# EAGLE design BioMod (EAGLE 9.5.1)

## Sheet 1 of 2
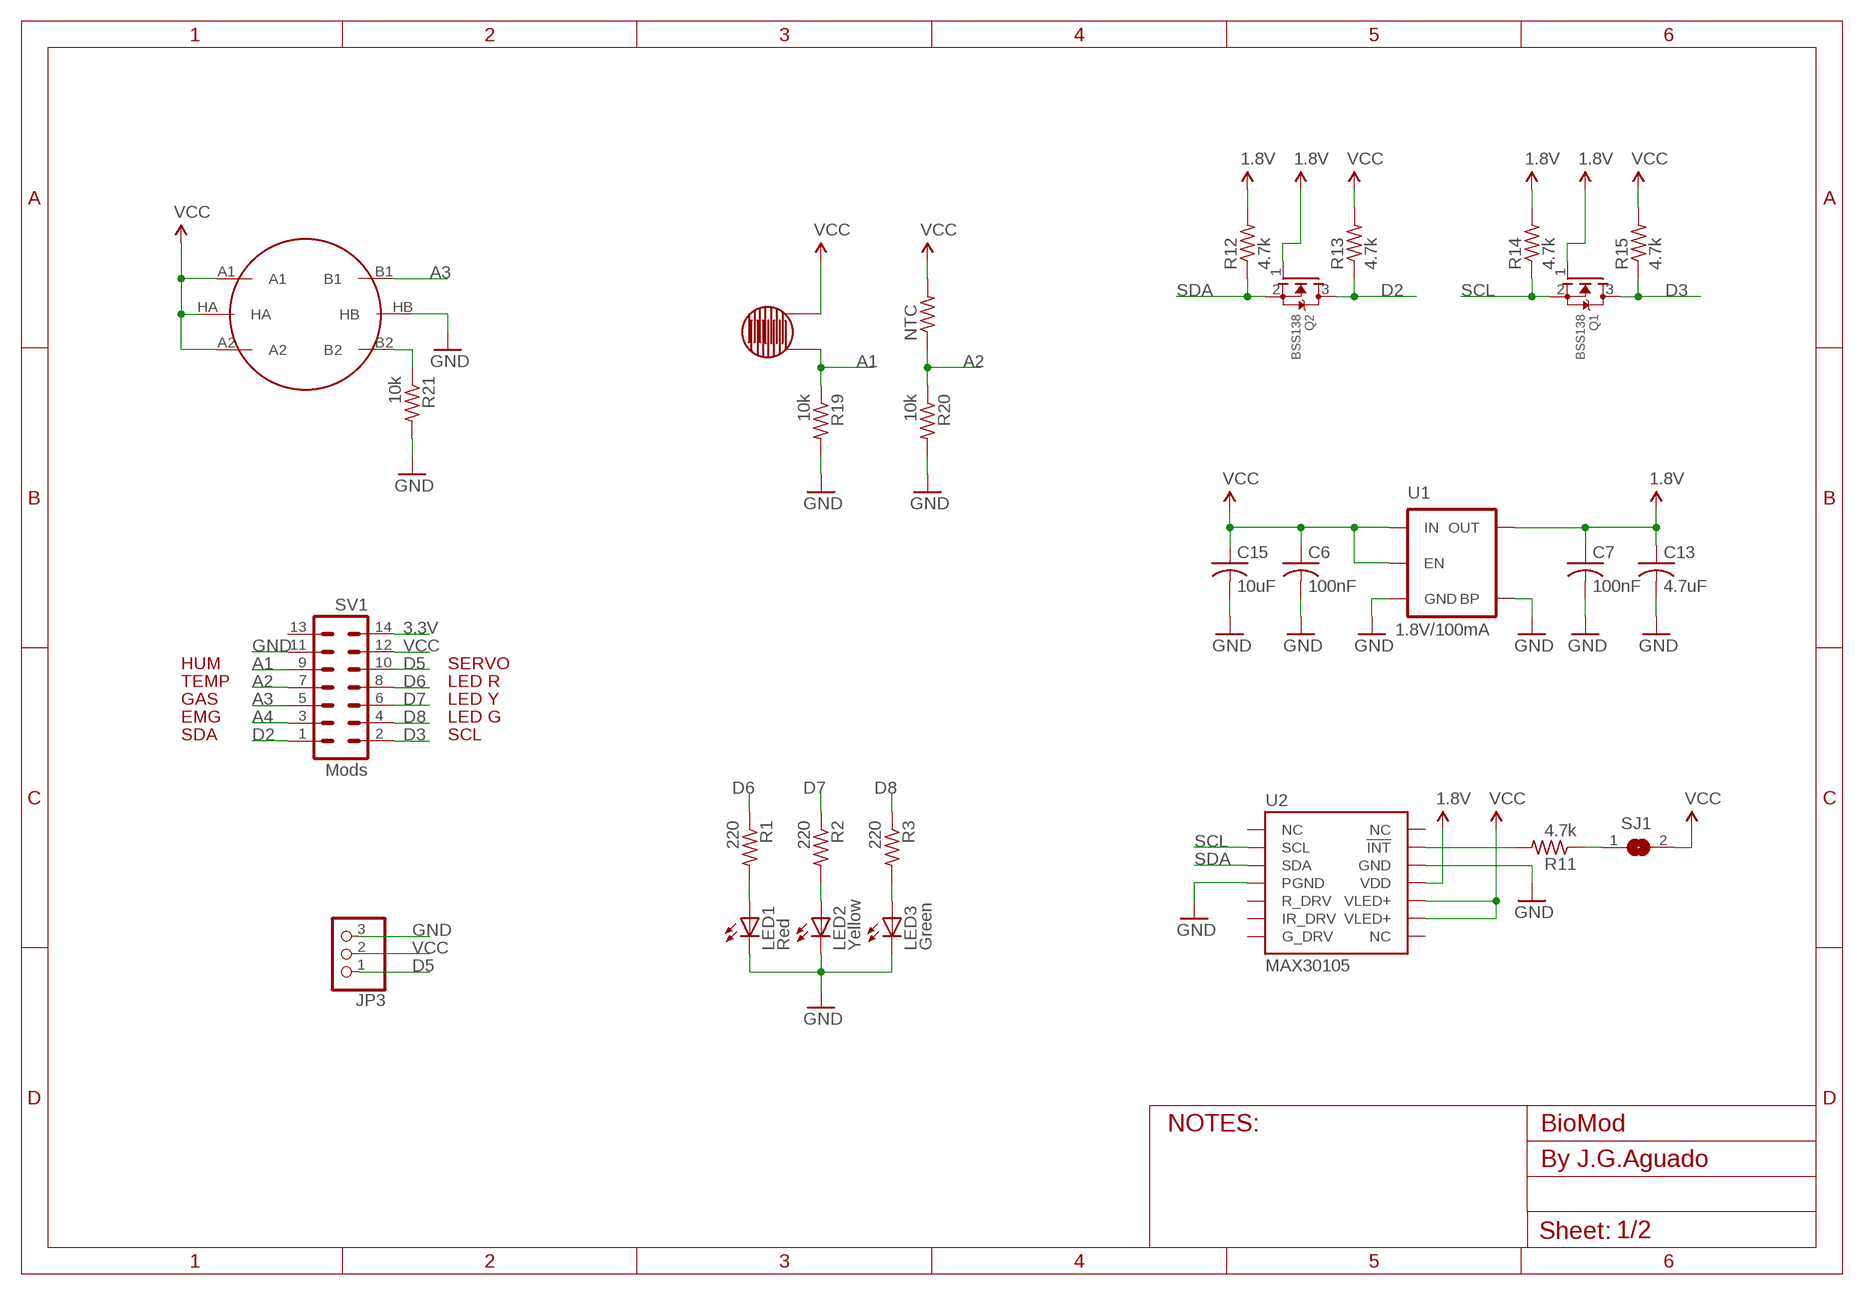
[diagram p0: schematic, sheet 1]

### Parts
C6  100nF  C-USC1206  [C1206]
C7  100nF  C-USC1206  [C1206]
C13  4.7uF  C-USC1206  [C1206]
C15  10uF  C-USC1206  [C1206]
JP3  PINHD-1X3  [1X03]
LED1  Red  LEDSMT1206  [1206]
LED2  Yellow  LEDSMT1206  [1206]
LED3  Green  LEDSMT1206  [1206]
NTC  R-US_R1206  [R1206]
Q1  BSS138  MOSFET-NREFLOW  [SOT23]
Q2  BSS138  MOSFET-NREFLOW  [SOT23]
R1  220  R-US_R1206  [R1206]
R2  220  R-US_R1206  [R1206]
R3  220  R-US_R1206  [R1206]
R11  4.7k  R-US_R1206  [R1206]
R12  4.7k  R-US_R1206  [R1206]
R13  4.7k  R-US_R1206  [R1206]
R14  4.7k  R-US_R1206  [R1206]
R15  4.7k  R-US_R1206  [R1206]
R19  10k  R-US_R1206  [R1206]
R20  10k  R-US_R1206  [R1206]
R21  10k  R-US_R1206  [R1206]
SJ1  SJ  [SJ]
SNG  METHANE_SENSOR  [MQ-3]
SV1  Mods  MA07-2  [MA07-2]
U1  1.8V/100mA  V_REG_SP62141.8V  [SC70]
U2  MAX30105  MAX30105SMD  [OLGA-14]
U$16  RESISTIVE_SENSOR_PAD  [RESISTIVE_SENSOR_PAD]

### Nets
1.8V: C7.1 C13.1 Q1.1(G) Q2.1(G) R12.2 R14.2 U1.5(OUT) U2.11(VDD)
3.3V: SV1.14
A1: R19.1 SV1.9 U$16.1
A2: NTC.1 R20.1 SV1.7
A3: SNG.B1 SV1.5
A4: SV1.3 ; also sheet 2
D2: Q2.3(D) R13.1 SV1.1
D3: Q1.3(D) R15.1 SV1.2
D5: JP3.1 SV1.10
D6: R1.1 SV1.8
D7: R2.1 SV1.6
D8: R3.1 SV1.4
GND: C6.2 C7.2 C13.2 C15.2 JP3.3 LED1.C LED2.C LED3.C R19.2 R20.2 R21.2 SNG.HB SV1.11 U1.2(GND) U1.4(BP) U2.4(PGND) U2.12(GND) ; also sheet 2
N$3: R11.1 SJ1.1
N$4: R11.2 U2.13(!INT)
N$11: R21.1 SNG.B2
N$12: LED2.A R2.2
N$13: LED3.A R3.2
N$14: LED1.A R1.2
SCL: Q1.2(S) R14.1 U2.2(SCL)
SDA: Q2.2(S) R12.1 U2.3(SDA)
VCC: C6.1 C15.1 JP3.2 NTC.2 R13.2 R15.2 SJ1.2 SNG.A1 SNG.A2 SNG.HA SV1.12 U1.1(IN) U1.3(EN) U2.9(VLED+) U2.10(VLED+) U$16.0 ; also sheet 2
Unconnected: SV1.13 U2.1(NC) U2.5(R_DRV) U2.6(IR_DRV) U2.7(G_DRV) U2.8(NC) U2.14(NC)

### Notes on the sheet
- HUM | SERVO
- TEMP | LED R
- GAS | LED Y
- EMG | LED G
- SDA | SCL

## Sheet 2 of 2
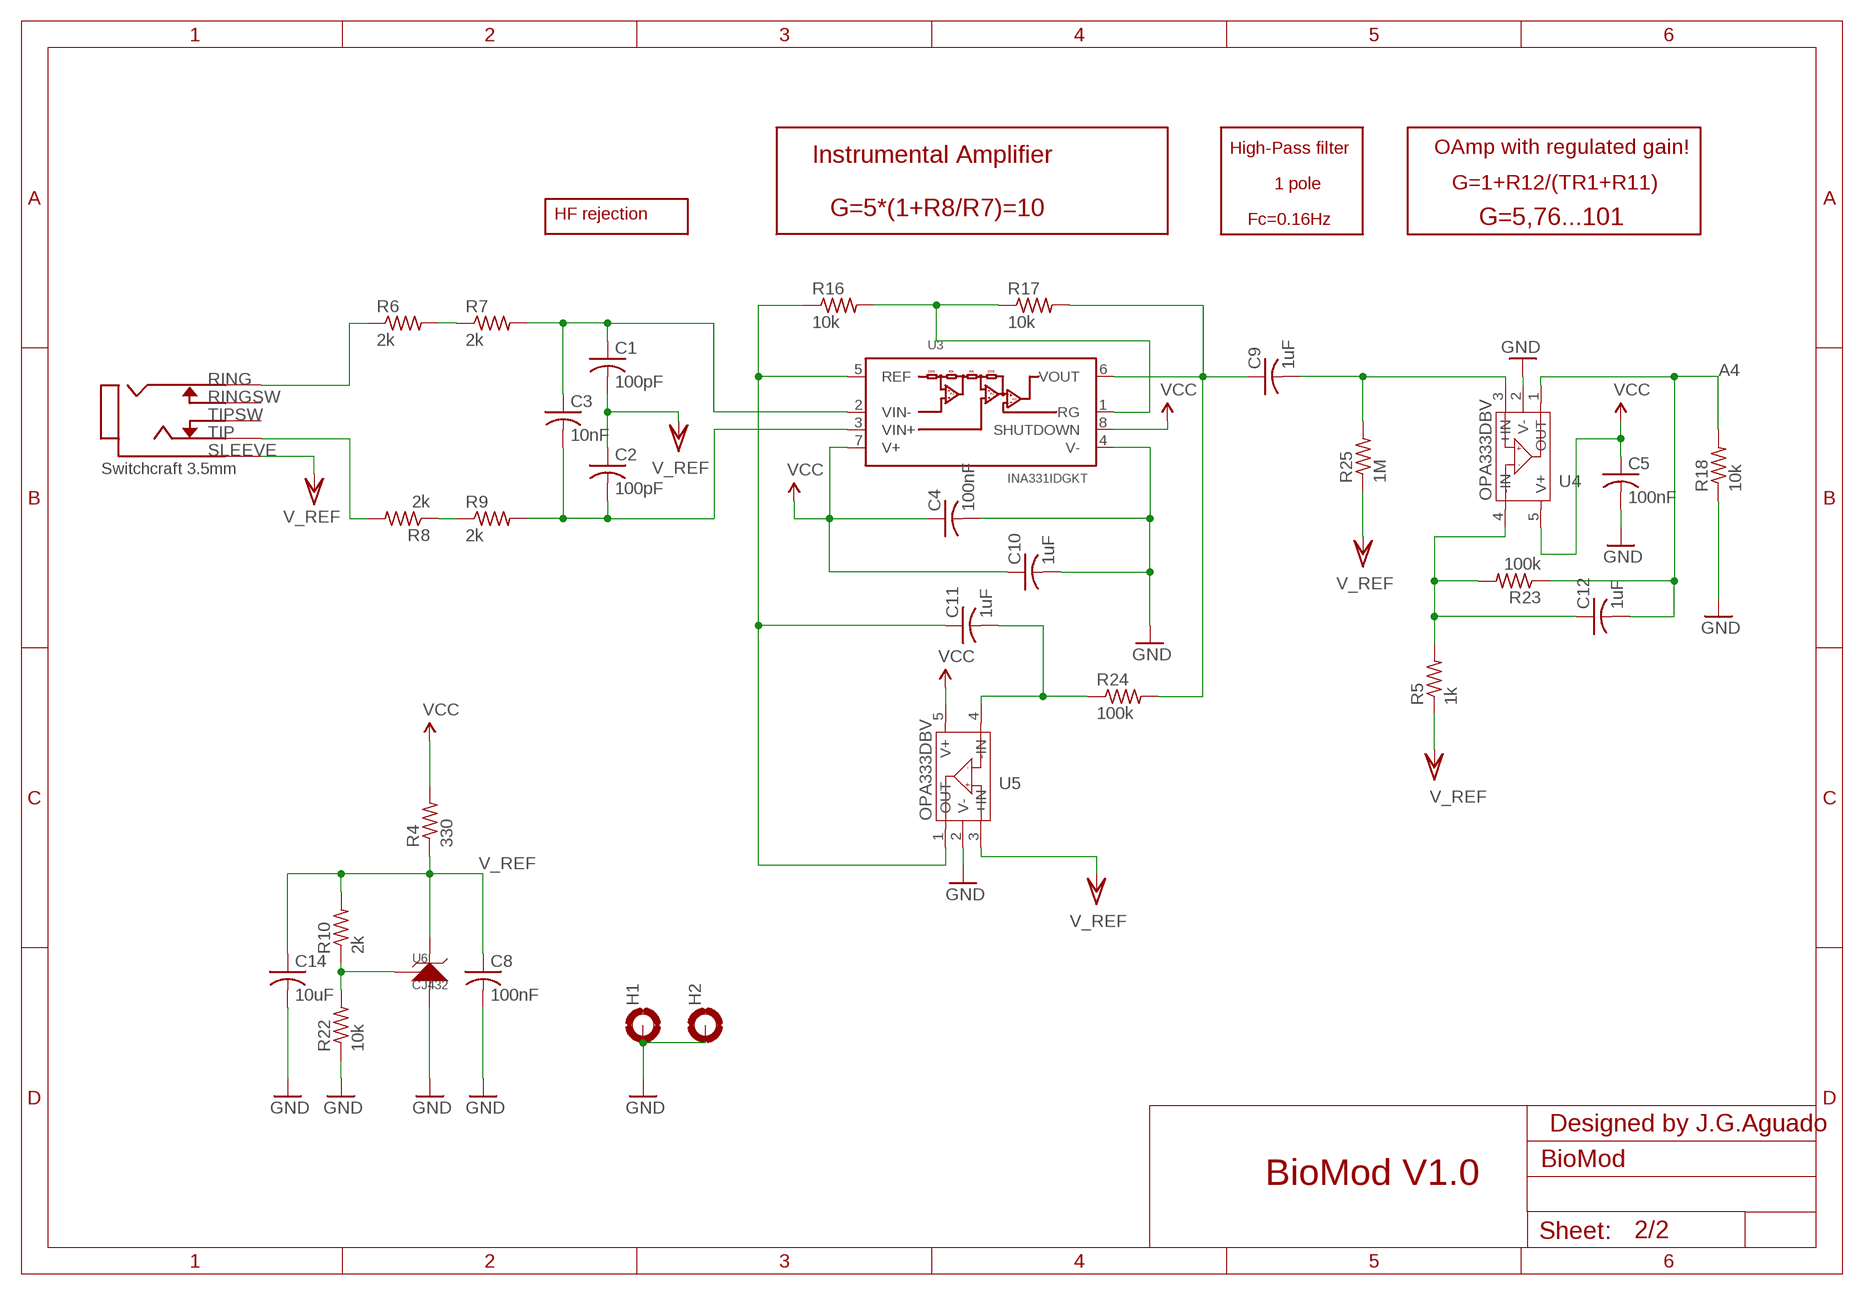
[diagram p1: schematic, sheet 2]

### Parts
C1  100pF  C-USC1206  [C1206]
C2  100pF  C-USC1206  [C1206]
C3  10nF  C-USC1206  [C1206]
C4  100nF  C-USC1206  [C1206]
C5  100nF  C-USC1206  [C1206]
C8  100nF  C-USC1206  [C1206]
C9  1uF  C-USC1206  [C1206]
C10  1uF  C-USC1206  [C1206]
C11  1uF  C-USC1206  [C1206]
C12  1uF  C-USC1206  [C1206]
C14  10uF  C-USC1206  [C1206]
H1  MOUNT-PAD-ROUND3.2  [3,2-PAD]
H2  MOUNT-PAD-ROUND3.2  [3,2-PAD]
JC1  SWTCHCRFT_3.5JACK5-JACK-SMD  [4-JACK-SMD]
R4  330  R-US_R1206  [R1206]
R5  1k  R-US_R1206  [R1206]
R6  2k  R-US_R1206  [R1206]
R7  2k  R-US_R1206  [R1206]
R8  2k  R-US_R1206  [R1206]
R9  2k  R-US_R1206  [R1206]
R10  2k  R-US_R1206  [R1206]
R16  10k  R-US_R1206  [R1206]
R17  10k  R-US_R1206  [R1206]
R18  10k  R-US_R1206  [R1206]
R22  10k  R-US_R1206  [R1206]
R23  100k  R-US_R1206  [R1206]
R24  100k  R-US_R1206  [R1206]
R25  1M  R-US_R1206  [R1206]
U3  INA331IDGKT  INA331EA  [MSOP-8]
U4  OPA333DBV  [SOT23-5]
U5  OPA333DBV  [SOT23-5]
U6  CJ432  REFERENCE-SOURCE  [SOT23]

### Nets
A4: C12.2 R18.2 R23.1 U4.1(OUT) ; also sheet 1
GND: C4.2 C5.2 C8.2 C10.2 C14.2 H1.B3,2(MOUNT) H2.B3,2(MOUNT) R18.1 R22.1 U3.4(V-) U4.2(V-) U5.2(V-) U6.3(A) ; also sheet 1
N$1: R8.1 R9.1
N$6: C11.2 R24.1 U5.4(-IN)
N$7: R6.2 R7.1
N$9: C11.1 R16.1 U3.5(REF) U5.1(OUT)
N$10: R16.2 R17.1 U3.1(RG)
N$15: JC1.2 R6.1
N$16: JC1.3 R8.2
N$22: R10.1 R22.2 U6.1(R)
N$83: C9.1 R17.2 R24.2 U3.6(VOUT)
N$92: C2.2 C3.2 R9.2 U3.3(VIN+)
N$93: C1.1 C3.1 R7.2 U3.2(VIN-)
N$102: C9.2 R25.2 U4.3(+IN)
N$105: C12.1 R5.2 R23.2 U4.4(-IN)
V_REF: C1.2 C2.1 C8.1 C14.1 JC1.1 R4.1 R5.1 R10.2 R25.1 U5.3(+IN) U6.2(K)
VCC: C4.1 C5.1 C10.1 R4.2 U3.7(V+) U3.8(SHUTDOWN) U4.5(V+) U5.5(V+) ; also sheet 1
Unconnected: JC1.4 JC1.5

### Notes on the sheet
- High-Pass filter | OAmp with regulated gain!
- Instrumental Amplifier
- 1 pole | G=1+R12/(TR1+R11)
- HF rejection
- G=5*(1+R8/R7)=10
- Fc=0.16Hz | G=5,76...101
- Designed by J.G.Aguado
- BioMod V1.0

## Library data of the parts
C1-C15 = resistor:C-US: CAPACITOR, American symbol
H1 H2 = holes:MOUNT-PAD-ROUND: MOUNTING PAD, round
JC1 = jmsaavedra:SWTCHCRFT_3.5JACK: Switchcraft 3.5mm Stereo Audio Jack manufacturer: 35RASMT4BHNTRX digikey: SC1488-1-ND
JP3 = pinhead:PINHD-1X3: PIN HEADER
LED1-LED3 = led:LED: LED OSRAM: - CHIPLED LG R971, LG N971, LY N971, LG Q971, LY Q971, LO R971, LY R971 LH N974, LH R974 LS Q976, LO Q976, LY Q976 LO Q996 - Hyper CHIPLED LW Q18S LB Q993, LB Q99A, LB R99A - SideLED LS A670, LO A670, LY A670, LG A670, LP A670 LB A673, LV A673, LT A673, LW A673 LH A674 LY A675 LS A676, LA A676, LO A676, LY A676, LW A676 LS A679, LY A679, LG A679 - Hyper Micro SIDELED® LS Y876, LA Y876, LO Y876, LY Y876 LT Y87S - SmartLED LW L88C, LW L88S LB L89C, LB L89S, LG L890 LS L89K, LO L89K, LY L89K LS L896, LA L896, LO L896, LY L896 - TOPLED LS T670, LO T670, LY T670, LG T670, LP T670 LSG T670, LSP T670, LSY T670, LOP T670, LYG T670 LG T671, LOG T671, LSG T671 LB T673, LV T673, LT T673, LW T673 LH T674 LS T676, LA T676, LO T676, LY T676, LB T676, LH T676, LSB T676, LW T676 LB T67C, LV T67C, LT T67C, LS T67K, LO T67K, LY T67K, LW E67C LS E67B, LA E67B, LO E67B, LY E67B, LB E67C, LV E67C, LT E67C LW T67C LS T679, LY T679, LG T679 LS T770, LO T770, LY T770, LG T770, LP T770 LB T773, LV T773, LT T773, LW T773 LH T774 LS E675, LA E675, LY E675, LS T675 LS T776, LA T776, LO T776, LY T776, LB T776 LHGB T686 LT T68C, LB T68C - Hyper Mini TOPLED® LB M676 - Mini TOPLED Santana® LG M470 LS M47K, LO M47K, LY M47K Source: http://www.osram.convergy.de LUXEON: - LUMILED® LXK2-PW12-R00, LXK2-PW12-S00, LXK2-PW14-U00, LXK2-PW14-V00 LXK2-PM12-R00, LXK2-PM12-S00, LXK2-PM14-U00 LXK2-PE12-Q00, LXK2-PE12-R00, LXK2-PE12-S00, LXK2-PE14-T00, LXK2-PE14-U00 LXK2-PB12-K00, LXK2-PB12-L00, LXK2-PB12-M00, LXK2-PB14-N00, LXK2-PB14-P00, LXK2-PB14-Q00 LXK2-PR12-L00, LXK2-PR12-M00, LXK2-PR14-Q00, LXK2-PR14-R00 LXK2-PD12-Q00, LXK2-PD12-R00, LXK2-PD12-S00 LXK2-PH12-R00, LXK2-PH12-S00 LXK2-PL12-P00, LXK2-PL12-Q00, LXK2-PL12-R00 Source: www.luxeon.com KINGBRIGHT: KA-3528ASYC Source: www.kingbright.com
NTC = adafruit:R-US_: RESISTOR, American symbol
Q1 Q2 = adafruit:MOSFET-N: N-Channel Mosfet 2N7002E - 60V 260mA SOT23 [Digikey: 2N7002ET1GOSTR-ND] - REEL BSH103 - 30V 850mA SOT23 [Digikey: 568-5013-1-ND]
R1-R25 = resistor:R-US_: RESISTOR, American symbol
SJ1 = jumper:SJ: SMD solder JUMPER
SNG = SparkFun-Sensors:METHANE_SENSOR: MQ-4 Methane Gas Sensor SEN-09404
SV1 = con-lstb:MA07-2: PIN HEADER; OC_FARNELL: unknown; OC_NEWARK: unknown
U1 = SparkFun-PowerIC:V_REG_SP6214; PROD_ID: VREG-08428
U2 = SparkFun-Sensors:MAX30105: Description: Particle Detection IC. Primarily used for smoke detection, can be used for Pulse Detection, Pulse Ox, and possible visual particle detection.; PROD_ID: IC-13510
U3 = template:INA331
U4 U5 = IC:OPA333: 1.8V,Micro power CMOS oprational amplifiers Zero-Drift Series http://www.ti.com.cn/cn/lit/ds/symlink/opa333.pdf
U6 = For_Test_Albert_v6:REFERENCE-SOURCE: CJ432,AZ432 or other Adjustable Reference Source
U$16 = SpaceDIY:RESISTIVE_SENSOR_PAD

## Net classes
1 pwr: width 0.152 mm, drill 0.305 mm, clearance 0.152 mm

## Board
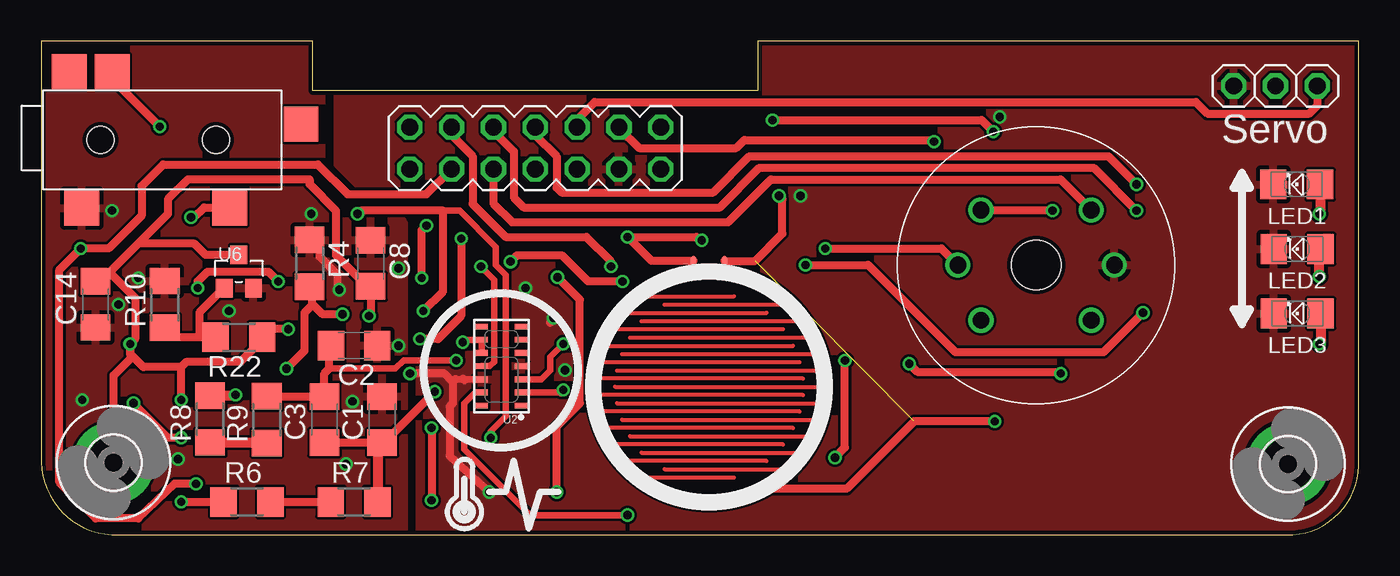
[diagram p2: board, top side]
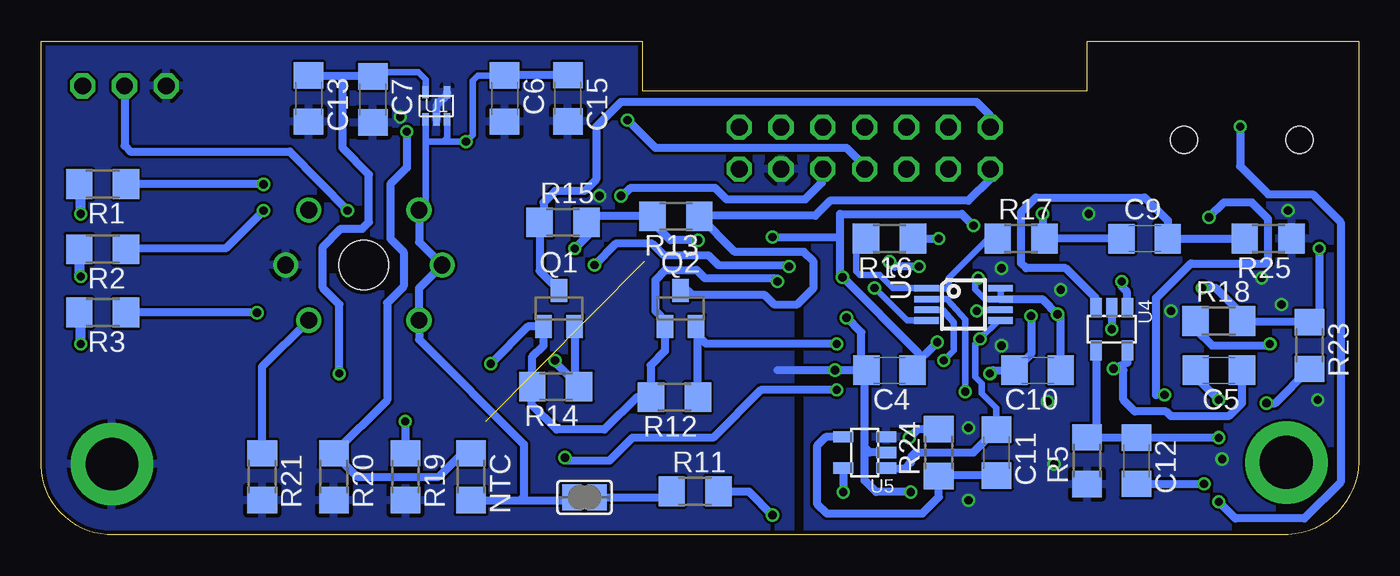
[diagram p3: board, bottom side, seen from below]

Size 80 x 30 mm. Coordinates in mm from the lower left corner, seen from the top.
Outline: 0,30 0,4.41 arc90 4.71,0 75.6,0 arc90 80,4.2 80,30 43.5,30 43.5,27 16.5,27 16.5,30 0,30
Copper layers (1*16): Top 0.035mm / dielectric 1.5mm / Bottom 0.035mm
Design rules "ITead_rule": minimum track width 6mil, minimum drill 12mil, track to track 6mil, track to pad 6mil, pad to pad 6mil, via to via 6mil, smd to smd 0mil, copper to edge 10mil, drill to drill 10mil, minimum pad ring 10mil, minimum via ring 6mil, stop-mask expansion 2mil, vias tented up to drill 100mil, thermal gap 10mil

### Footprints (pad centres in the part's own frame; a part is rotated, then mirrored left to right if it is on the bottom)
C1206 = smd 1.6 x 1.8: 1 -1.4,0; 2 1.4,0
3,2-PAD = drill 3.2 pad 5: B3,2 0,0
4-JACK-SMD = smd 2.108 x 2.108: 1 2.362,-1.143; 2 4.216,7.137; 3 11.354,-1.143; 4 1.6,7.137; 5 15.672,3.962 | hole 1.651: 3.505,2.997; 10.516,2.997
1X03 = drill 1.016 octagon: 1 -2.54,0; 2 0,0; 3 2.54,0
1206 = smd 1.6 x 1.803: A -1.422,0; C 1.422,0
R1206 = smd 1.6 x 1.803: 1 -1.422,0; 2 1.422,0
SOT23 = smd 1 x 1.4: 1 -0.95,-1.1; 2 0.95,-1.1; 3 0,1.1
SJ = smd 1.168 x 1.6: 1 -0.762,0; 2 0.762,0
MQ-3 = drill 1.016: A1 -3.35,3.35; A2 -3.35,-3.35; B1 3.35,3.35; B2 3.35,-3.35; HA -4.75,0; HB 4.75,0 | hole 3: 0,0
MA07-2 = drill 1.016 octagon: 1 -7.62,-1.27; 2 -7.62,1.27; 3 -5.08,-1.27; 4 -5.08,1.27; 5 -2.54,-1.27; 6 -2.54,1.27; 7 0,-1.27; 8 0,1.27; 9 2.54,-1.27; 10 2.54,1.27; 11 5.08,-1.27; 12 5.08,1.27; 13 7.62,-1.27; 14 7.62,1.27
SC70 = smd 0.4 x 0.75: 1 -0.65,-0.825; 2 0,-0.825; 3 0.65,-0.825; 4 0.65,0.825; 5 -0.65,0.825
OLGA-14 = smd 0.75 x 0.35: 1 -1.2,2.4; 2 -1.2,1.6; 3 -1.2,0.8; 4 -1.2,0; 5 -1.2,-0.8; 6 -1.2,-1.6; 7 -1.2,-2.4; 8 1.2,-2.4; 9 1.2,-1.6; 10 1.2,-0.8; 11 1.2,0; 12 1.2,0.8; 13 1.2,1.6; 14 1.2,2.4
MSOP-8 = smd 0.4 x 1.5: 1 -0.975,-2.25; 2 -0.325,-2.25; 3 0.325,-2.25; 4 0.975,-2.25; 5 0.975,2.25; 6 0.325,2.25; 7 -0.325,2.25; 8 -0.975,2.25
SOT23-5 = smd 0.69 x 1.2: 1 -0.95,-1.3; 2 0,-1.3; 3 0.95,-1.3; 4 0.95,1.3; 5 -0.95,1.3
SOT23' = smd 1.016 x 1.143: 1 -0.889,-1.016; 2 0.889,-1.016; 3 0,1.016
RESISTIVE_SENSOR_PAD = smd 0.305 x 0.61: 0 -0.95,7.65; 1 0.95,7.65

### Placement (x,y rotation side)
C1  20.7,7 90 top
C2  19,11.5 180 top
C3  17.2,7 90 top
C4  28.5,10 180 bottom
C5  8.5,10 180 bottom
C6  51.86,26.51 270 bottom
C7  59.86,26.46 270 bottom
C8  20,16.5 270 top
C9  13,18 0 bottom
C10  19.5,10 180 bottom
C11  22,5 270 bottom
C12  13.5,4.5 270 bottom
C13  63.76,26.51 270 bottom
C14  3.3,14 90 top
C15  48.02,26.53 270 bottom
H1  4.4,4.4 0 top
H2  75.7,4.3 0 top
JC1  0.1,21 0 top
JP3  74.94,27.28 180 top
LED1  76.23,21.29 180 top
LED2  76.26,17.37 180 top
LED3  76.26,13.45 180 top
NTC  53.9,3.53 270 bottom
Q1  48.56,13.75 0 bottom
Q2  41.18,13.75 0 bottom
R1  76.27,21.31 180 bottom
R2  76.27,17.36 180 bottom
R3  76.27,13.51 180 bottom
R4  16.3,16.5 270 top
R5  16.5,4.5 90 bottom
R6  12.5,2 0 top
R7  19,2 0 top
R8  10.26,7.04 90 top
R9  13.7,7 90 top
R10  7.5,14 90 top
R11  40.29,2.64 0 bottom
R12  41.55,8.36 180 bottom
R13  41.47,19.36 180 bottom
R14  48.76,9.01 180 bottom
R15  48.32,18.99 0 bottom
R16  28.5,18 180 bottom
R17  20.5,18 0 bottom
R18  8.5,13 0 bottom
R19  57.88,3.53 270 bottom
R20  62.23,3.53 270 bottom
R21  66.58,3.53 270 bottom
R22  12,12 180 top
R23  3,11.5 270 bottom
R24  25.5,5 90 bottom
R25  5.5,18 180 bottom
SJ1  47.01,2.28 180 bottom
SNG  60.41,16.39 0 top
SV1  30,23.5 0 top
U1  56.01,26.07 0 bottom
U2  27.94,10.25 180 top
U3  24,14 270 bottom
U4  15,12.5 180 bottom
U5  30,5 90 bottom
U6  CJ432  [SOT23']  12,16 0 top
U$16  40.55,8.99 0 top

### Tracks (layer width: path | path; a pad name or v marks a point on that pad's centre or on a via)
1.8V  (via drill 0.5)
  Top 0.406: U2.11 27.25,10.25 27.5,10.5 27.5,15.5 v26.7,16.3
  Top 0.5: v28.5,16.6 28.9,17 31.6,17 33.2,15.4 v35.3,15.4 | v52.7,10.4 53.2,9.9 61.8,9.9 v61.9,9.8
  Bottom 0.406: U1.5 56.66,27.66 57.1,28.1 59.62,28.1 C7.1
  Bottom 0.5: v26.7,16.3 28.2,16.3 v28.5,16.6 | C7.1 61.9,27.86 | 61.9,27.86 63.71,27.86 C13.1 | v52.7,10.4 50.45,12.65 Q1.1 49.51,11.49 50.2,10.8 50.2,9.03 R14.2 50.2,8.99 50.2,7.9 48.7,6.4 45.8,6.4 43.84,8.36 R12.2 43,8.39 43,10.3 42.13,11.17 Q2.1 41.9,12.88 41.98,12.88 42.7,13.6 42.7,15.5 42.1,16.1 40.2,16.1 39.7,15.6 35.3,15.6 v35.3,15.4 | v61.9,9.8 61.9,14 62.9,15 62.9,17.5 61.8,18.6 60.5,18.6 60.1,19 60.1,21.9 61.7,23.5 61.7,27.66 61.9,27.86
A1  (via drill 0.5)  (1 unrouted)
  Top 0.5: v57.9,6.9 53,6.9 48.9,2.8 44.2,2.8 | U$16.1 43.34,16.64 45,18.3 45,20.4 v44.8,20.6
  Bottom 0.5: R19.1 57.88,6.88 v57.9,6.9 | v44.8,20.6 44.7,20.6 44.2,21.1 39.1,21.1 38.4,20.4 33.6,20.4 32.6,21.4 32.6,22.17 SV1.9
A2  (via drill 0.5)
  Top 0.5: v44.4,25.2 57.1,25.2 v57.8,24.5
  Bottom 0.5: NTC.1 54.45,4.95 55.9,3.5 60.78,3.5 R20.1 59,8.18 59,14.1 58,15.1 58,17.2 58.8,18 58.8,21.3 57.8,22.3 v57.8,24.5 | SV1.7 30,22.4 31.1,23.5 42.7,23.5 v44.4,25.2
A3
  Top 0.5: SV1.5 27.46,20.14 28.6,19 41.7,19 44.3,21.6 61.9,21.6 SNG.B1
A4  (via drill 0.5)
  Top 0.5: v9.5,15 9.5,15.4 10.1,16 13.8,16 v14.4,15.4 | v9.4,3.1 8.1,3.1 5.9,1 3.3,1 1.1,3.2 1.1,16.1 v2.4,17.4 4.1,17.4 6.1,19.4 6.1,21.2 7.4,22.5 16.8,22.5 18.6,20.7 23.39,20.7 SV1.3
  Bottom 0.5: v14.4,15.4 14.4,15.1 14.1,14.8 14.1,13.85 U4.1 | v9.5,15 8.7,15 7.08,13.38 R18.2 7,12.92 R23.1 2.4,13.52 v2.4,17.4 | C12.2 v9.4,3.1
D2
  Bottom 0.5: SV1.1 22.38,21.62 23.7,20.3 32.1,20.3 33,19.4 40.01,19.4 R13.1 37.89,17.2 33.7,17.2 33.1,16.6 33.1,15 34.1,14 35.5,14 36.1,14.6 40.5,14.6 40.75,14.85 Q2.3
D3
  Bottom 0.5: Q1.3 49.74,16.03 R15.1 49.5,19.23 49.5,20.2 48.8,20.9 47,20.9 46.3,21.6 46.3,24.8 44.8,26.3 23.2,26.3 22.38,25.48 SV1.2
D5
  Top 0.5: SV1.10 32.54,25.24 33.6,26.3 70.1,26.3 70.8,25.6 77,25.6 77.5,26.1 77.5,27.26 JP3.1
D6  (via drill 0.5)
  Top 0.5: SV1.8 30,24.3 31.3,23 31.3,21.1 31.6,20.8 40.8,20.8 43,23 64.8,23 v66.5,21.3
  Bottom 0.5: v66.5,21.3 74.84,21.3 R1.1
D7  (via drill 0.5)
  Top 0.5: SV1.6 27.46,24.54 28.7,23.3 28.7,20.5 29.3,19.9 41.2,19.9 43.6,22.3 63.9,22.3 v66.5,19.7
  Bottom 0.5: v66.5,19.7 68.8,17.4 74.81,17.4 R2.1
D8  (via drill 0.5)
  Top 0.5: SV1.4 24.92,24.28 26.2,23 26.2,20.1 28.2,18.1 33.1,18.1 34.6,16.6 v34.6,16.3 | v46.4,16.4 50.2,16.4 55.5,11.1 64.5,11.1 v66.9,13.5
  Bottom 0.5: v46.4,16.4 45.1,17.7 42.9,17.7 42.2,17 39.5,17 38.9,16.4 34.7,16.4 v34.6,16.3 | v66.9,13.5 74.84,13.5 R3.1
GND  (via drill 0.5)
  Top 0.406: 25.85,9.45 U2.12 25.15,9.45
  Top 0.5: U6.3 9.98,17.02 9.3,17.7 5.9,17.7 | 5.9,17.7 4.1,15.9 | C8.2 19.5,15.1 | 5.9,17.7 7.7,19.5 7.7,20.4 8.9,21.6 16.3,21.6 16.3,21.3 17.9,19.7 17.9,17 19.8,15.1 C8.2 | C8.2 20,13.4 v19.9,13.3 | 4.1,15.9 3.8,15.9 C14.2 | v8.5,8.2 8.5,10.2 | 8.5,10.2 6.2,10.2 5.55,10.85 | 5.55,10.85 5.4,11 v5.4,11.6 | H1.B3,2 4.4,9.7 5.4,10.7 | 5.4,10.7 5.55,10.85 | 8.5,10.2 8.8,10.5 12.1,10.5 13.4,11.8 13.4,11.98 R22.1 13.92,12.5 v15,12.5 | v5.4,11.6 5.4,10.7 | 4.1,15.9 4.2,15.9 5.7,14.4 5.7,11.9 v5.4,11.6 | 25.7,9.4 25.6,9.5 | 25.15,9.45 25,9.3 | 25,9.3 25,8 24.8,7.8 24.8,4.8 v27.2,2.6 | v29.4,15 29.6,15 | v31.1,13.2 31.1,13.1 30.9,12.9 | 25,9.3 24.5,9.8 v22.4,9.8
  Bottom 0.406: U3.4 27.43,13.03 v29.4,15
  Bottom 0.5: C5.2 9.9,9.6 v8.5,8.2 | v19.9,13.3 19.9,11 C10.2 22.2,10 v22.4,9.8 | U5.2 29.7,5 30,5.3 | 30,5.3 30,9.9 C4.2 | C4.2 v31.8,10 35.3,10 | R18.1 9.92,12.52 8.9,11.5 5.5,11.5 v5.4,11.6 | U4.2 v15,12.5 | v27.2,2.6 29.3,2.6 30,3.3 30,5.3 | C4.2 30.2,10 30.2,12.3 v31.1,13.2 | U1.4 55.36,26.74 56,26.1 U1.2
  other vias: 46.1,20.6 58.2,25.4
  pour Bottom: 0,30 16.5,30 16.5,27 43.5,27 43.5,30 80,30 80,4.3 arc-90 76,0 34.5,0 34.5,19.5 33,21 0,21
  pour Top: 18,27 43.5,27 43.5,30 80,30 80,4.3 arc-90 76,0 23,0 23,19.5 21.5,21 19.5,21 18,22.5
N$1
  Top 0.61: R8.1 14,5.62 R9.1
N$3
  Bottom 0.5: SJ1.1 42.07,2.28 R11.1
N$4  (via drill 0.5)
  Top 0.406: v35.6,1.2 29.7,1.2 25.7,5.2 25.7,8 26.35,8.65 U2.13
  Bottom 0.5: R11.2 37.04,2.64 v35.6,1.2
N$6
  Bottom 0.5: C11.2 25.48,3.6 R24.1 25.5,2.3 26.5,1.3 32.3,1.3 32.9,1.9 32.9,5.4 32.35,5.95 U5.4
N$7
  Top 0.5: R6.2 R7.1
N$9  (via drill 0.5)
  Top 0.5: v25.5,18 25.5,13.3 24.1,11.9 v23,11.9
  Bottom 0.406: U3.5 21.88,13.03 v23,11.9 23.3,11.6 23.3,9.6 22.9,9.2 22.9,8.6 22,7.7 C11.1
  Bottom 0.5: R16.1 v25.5,18 | U5.1 27.55,4.05 27.2,4.4 27.2,4.7 26.9,5 23.4,5 C11.1 | 22.9,11.8 v23,11.9
N$10
  Bottom 0.406: U3.1 25.73,14.97 | 22.5,18 24.9,15.6 24.9,15 24.93,14.97 U3.1 | U3.1 26.43,15 28.3,15 29.1,15.8 30.3,15.8 30.5,16 30.5,17.9
  Bottom 0.5: R17.1 22.5,18 | 29.9,17.98 R16.2 30.4,18 30.5,17.9
N$11
  Bottom 0.5: R21.1 66.58,10.22 SNG.B2
N$12  (via drill 0.5)
  Top 0.61: v77.6,15.7 77.6,17.29 arc-90 LED2.A
  Bottom 0.61: R2.2 77.69,15.79 arc-90 v77.6,15.7
N$13  (via drill 0.5)
  Top 0.61: LED3.A 77.68,11.68 arc-90 v77.6,11.6
  Bottom 0.61: v77.6,11.6 77.6,13.42 arc-90 R3.2
N$14  (via drill 0.5)
  Top 0.61: LED1.A 77.65,19.55 arc-90 v77.6,19.5
  Bottom 0.61: v77.6,19.5 77.6,21.22 arc-90 R1.2
N$15  (via drill 0.5)
  Top 0.5: JC1.2 4.32,27.68 v7.2,24.8 | v8.5,2 R6.1
  Bottom 0.5: v7.2,24.8 7.2,22.4 5.5,20.7 2.8,20.7 1.1,19 1.1,3.2 3.3,1 7.5,1 v8.5,2
N$16  (via drill 0.5)
  Top 0.5: 11.92,8.42 11.8,8.42 v11.8,8.5 11.9,8.4 | v9.1,19.3 9.3,19.3 9.9,19.9 11.41,19.9 JC1.3
  Top 0.61: R8.2 11.8,8.46 v11.8,8.5
  Bottom 0.5: v11.8,8.5 12.3,8.5 12.3,14.4 10.2,16.5 5.6,16.5 5.5,16.6 5.5,19.2 6.5,20.2 8.2,20.2 v9.1,19.3
N$22
  Top 0.5: R22.2 9.7,12 | 9.7,12 8.08,12 R10.1 | U6.1 11.08,14.98 9.6,13.5 9.6,12.1 9.7,12
N$83  (via drill 0.5)
  Top 0.406: v27.3,5.9 27.3,6.3 28.2,7.2 28.2,15.8 27.6,16.4 27.6,17.5 25.4,19.7 24.4,19.7
  Top 0.5: v19.2,19.5 19.4,19.7 24.4,19.7 24.4,14.8 v23.2,13.6
  Bottom 0.406: U3.6 23.18,13.68
  Bottom 0.5: C9.1 R17.2 19.2,18.12 v19.2,19.5 | R24.2 26.78,6.42 v27.3,5.9 | 23.18,13.68 v23.2,13.6
N$92  (via drill 0.5)
  Top 0.406: v25.2,10.6 22,10.6 21.5,10.1 17.5,10.1
  Top 0.5: R9.2 16.98,8.42 C3.2 17.2,9.8 17.5,10.1 17.5,11.4 C2.2
  Bottom 0.406: U3.3 25.27,13.68 24.6,12.9 24.6,11.2 v25.2,10.6
N$93  (via drill 0.5)
  Top 0.5: C3.1 C1.1 20.8,5.6 v23.9,8.7 23.95,8.75
  Top 0.61: 20.8,5.6 20.42,5.6 R7.2
  Bottom 0.406: U3.2 25.02,14.32 25,14.3 23.9,13.1 v23.9,8.7
N$102
  Bottom 0.5: R25.2 C9.2 11.6,19.1 13,20.5 19.6,20.5 20.5,19.6 20.5,16.5 20.2,16.2 17.8,16.2 15.95,14.35 U4.3
N$105  (via drill 0.5)
  Top 0.5: v8.5,5.9 7.7,5.9 v5.6,8
  Bottom 0.5: 3.12,10.08 R23.2 5.08,8 v5.6,8 | v8.5,5.9 C12.1 16.48,5.9 R5.2 15.95,6.47 U4.4
SCL  (via drill 0.5)
  Top 0.406: U2.2 31.55,8.65
  Top 0.5: 31.55,8.65 v31.7,8.8 | v48.2,4.7 48.8,5.3 v48.8,10.6
  Bottom 0.5: v31.7,8.8 36.3,8.8 39.2,5.9 44.1,5.9 45.5,4.5 48,4.5 v48.2,4.7 | v48.8,10.6 48.8,10.47 R14.1 47.61,9.28 Q1.2
SDA  (via drill 0.5)
  Top 0.406: U2.3 30.35,9.45 30.9,10 30.9,10.8 v31.7,11.6
  Bottom 0.5: R12.1 40.13,12.1 | 40.13,12.1 40.13,12.55 Q2.2 | v31.7,11.6 39.63,11.6 40.13,12.1
V_REF  (via drill 0.5)
  Top 0.5: v23.7,6.5 v23.7,2.1 | 16.4,17.82 R4.1 16.9,17.32 16.9,16.9 18,15.8 18,15 v18.1,14.9
  other vias: 5.9,15.6 2.5,8.2 4.3,19.7 8.3,4.6 18.5,4.3 11.4,13.6 21.7,11.5 18.9,8.1 16.4,19.5 4.7,14 21.7,16.2
  pour Bottom: 0,20 32.5,20 33.5,19 33.5,0 4.5,0 arc-90 0,4.6
  pour Top: 22,0 4.2,0 arc-90 0,4.6
  pour Top: 0,30 16.5,30 16.5,27 17,27 17,22 19,20 21,20 22,19 22,0 4.2,0 arc-90 0,4.6
VCC  (via drill 0.5)
  Top 0.406: U2.10 U2.9 25.75,11.85 v25.6,11.7
  Top 0.5: v18.3,13.4 17.1,13.4 16.5,14 | 16.5,14 R4.2 | 16.5,14 16,13.5 16,11.2 v14.9,10.1 | v23.1,15.6 23.1,18.5 v23.4,18.8 | v31.3,2.6 31.3,6.6 32.7,8 32.7,14.3 v31.34,15.65 | U$16.0 37.06,16.64 v35.6,18.1 39.8,18.1 v40.1,17.9 | v61.4,19.7 57.1,19.7 SNG.A1 | v47.6,17.4 54.65,17.4 SNG.HA | SV1.12 35.08,24.72 36.3,23.5 42.2,23.5 42.7,24 54.1,24 v54.2,23.9
  Bottom 0.406: U3.8 U3.7 22.73,14.32 23.3,14.9 23.3,15.4 v23.1,15.6 | U1.3 55.36,24.14 55.6,23.9 | SNG.A1 56.66,20.14 U1.1 56.66,23.96 56.6,23.9 55.6,23.9 | C6.1 53.49,27.91 53.8,27.6 53.8,24.3 54.15,23.95 | v54.2,23.9 55.6,23.9
  Bottom 0.5: C10.1 18.1,13.2 v18.3,13.4 19.23,14.32 U3.7 | U4.5 14.05,10.45 v14.9,10.1 14.3,10 14.3,8.2 13.6,7.5 11.7,7.5 11.4,7.2 7.9,7.2 7.1,8 C5.1 | 27.2,9.9 C4.1 | R13.2 43,19.25 43,18.9 | R13.2 46.53,19.36 | 46.53,19.36 R15.2 | SNG.A1 57.06,17.79 SNG.HA 57.06,14.99 SNG.A2 57.06,11.86 50.7,5.5 50.7,2.31 50.9,2.11 | NTC.2 50.9,2.11 | 50.9,2.11 47.94,2.11 SJ1.2 | C4.1 27.1,10.2 v25.6,11.7 | v23.4,18.8 24.1,19.5 31.5,19.5 31.5,18.1 | 31.5,18.1 31.5,15.81 v31.34,15.65 U2.10 26.74,10.36 C4.1 | U5.5 31.3,2.7 v31.3,2.6 | C15.1 51.84,27.93 C6.1 | JP3.2 74.94,23.64 74.6,23.3 64.9,23.3 v61.4,19.7 | 46.53,19.36 46.53,18.47 v47.6,17.4 | v54.2,23.9 54.15,23.95 | v35.6,18.1 31.5,18.1 | v40.1,17.9 41.8,17.9 42.6,18.7 42.6,19.07 R13.2

### Text on the board
tPlace: Servo